# EAGLE schematic ig-normal2ver3 (EAGLE 9.6.2)
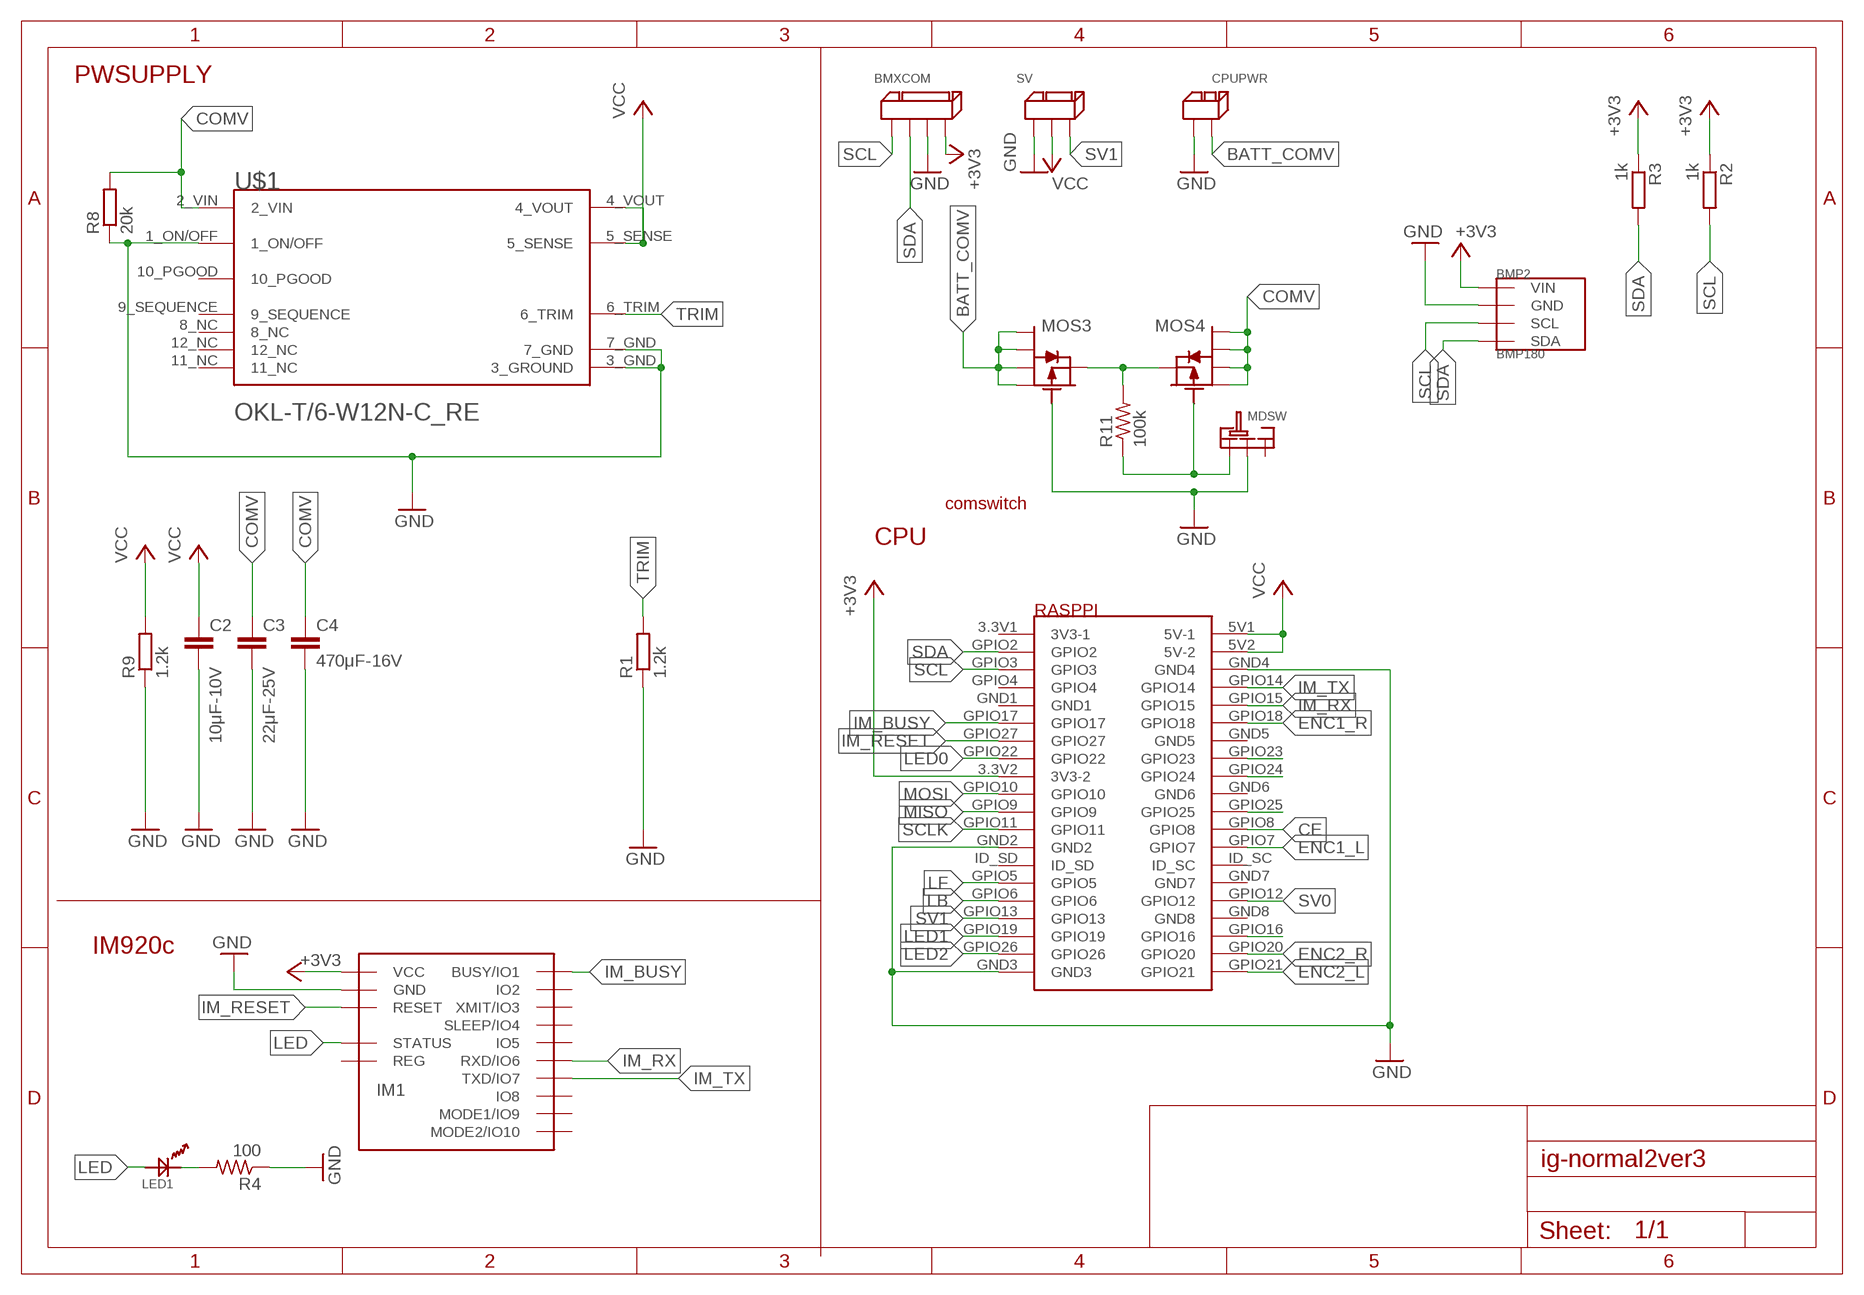
[diagram p0: schematic, sheet 1]

## Parts
BMP2  BMP180  [GY-68]
BMXCOM  4PIN  [4PIN]
C2  10μF-10V  C-EUC0603  [C0603]
C3  22μF-25V  C-EUC0603  [C0603]
C4  470μF-16V  C-EUC0603  [C0603]
CPUPWR  2PIN  [2PIN]
IM1  IM920_IM920C  [IM920_IM920C]
LED1  OSXX1608C1A  [OSXX1608C1A]
MDSW  SRIDE_SWITCH  [SRIDE_SWITCH]
MOS3  PCH_SSM6J808R  [SSM6J808R]
MOS4  PCH_SSM6J808R  [SSM6J808R]
R1  1.2k  R-EU_R0805  [R0805]
R2  1k  R-EU_R0603  [R0603]
R3  1k  R-EU_R0603  [R0603]
R4  100  R-US_R0603  [R0603]
R8  20k  R-EU_R0603  [R0603]
R9  1.2k  R-EU_R0805  [R0805]
R11  100k  R-US_R0603  [R0603]
RASPPI  RASPBERYPIZEROW  [RASPBERYPIZEROW]
SV  3PIN  [3PIN]
U$1  OKL-T/6-W12N-C_RE  [MURATA_IKL-T-6-W12N-C_0_RECOMENDED]

## Nets
+3V3: BMP2.P1(VIN) BMXCOM.P$4 IM1.$P17(VCC) R2.1 R3.1 RASPPI.3.3V2(3V3-2)
BATT_COMV: CPUPWR.P$2 MOS3.1 MOS3.2 MOS3.5 MOS3.6
CE: RASPPI.GPIO8
COMV: C3.1 C4.1 MOS4.1 MOS4.2 MOS4.5 MOS4.6 R8.2 U$1.2_VIN
ENC1_L: RASPPI.GPIO7
ENC1_R: RASPPI.GPIO18
ENC2_L: RASPPI.GPIO21
ENC2_R: RASPPI.GPIO20
GND: BMP2.P2(GND) BMXCOM.P$3 C2.2 C3.2 C4.2 CPUPWR.P$1 IM1.$P18(GND) MDSW.LR MOS3.3 R1.1 R4.1 R8.1 R9.1 RASPPI.GND2 RASPPI.GND3 RASPPI.GND4 SV.P$1 U$1.1_ON/OFF U$1.3_GND(3_GROUND) U$1.7_GND
IM_BUSY: IM1.$P1(BUSY/IO1) RASPPI.GPIO17
IM_RESET: IM1.$P19(RESET) RASPPI.GPIO27
IM_RX: IM1.$P6(RXD/IO6) RASPPI.GPIO15
IM_TX: IM1.$P7(TXD/IO7) RASPPI.GPIO14
LB: RASPPI.GPIO6
LB1: RASPPI.GPIO16
LED: IM1.$P15(STATUS) LED1.AN
LED0: RASPPI.GPIO22
LED1: RASPPI.GPIO19
LED2: RASPPI.GPIO26
LF: RASPPI.GPIO5
LF1: RASPPI.GPIO25
MISO: RASPPI.GPIO9
MOSI: RASPPI.GPIO10
N$3: LED1.CT R4.2
N$9: MOS3.4 MOS4.4 R11.2
N$10: MDSW.L MOS4.3 R11.1
RB1: RASPPI.GPIO24
RF1: RASPPI.GPIO23
SCL: BMP2.P3(SCL) BMXCOM.P$1 R2.2 RASPPI.GPIO3
SCLK: RASPPI.GPIO11
SDA: BMP2.P4(SDA) BMXCOM.P$2 R3.2 RASPPI.GPIO2
SV0: RASPPI.GPIO12
SV1: RASPPI.GPIO13 SV.P$3
TRIM: R1.2 U$1.6_TRIM
VCC: C2.1 R9.2 RASPPI.5V1(5V-1) RASPPI.5V2(5V-2) SV.P$2 U$1.4_VOUT U$1.5_SENSE
Unconnected: IM1.$P2(IO2) IM1.$P3(XMIT/IO3) IM1.$P4(SLEEP/IO4) IM1.$P5(IO5) IM1.$P8(IO8) IM1.$P9(MODE1/IO9) IM1.$P10(MODE2/IO10) IM1.$P16(REG) MDSW.R RASPPI.3.3V1(3V3-1) RASPPI.GND1 RASPPI.GND5 RASPPI.GND6 RASPPI.GND7 RASPPI.GND8 RASPPI.GPIO4 RASPPI.ID_SC RASPPI.ID_SD U$1.8_NC U$1.9_SEQUENCE U$1.10_PGOOD U$1.11_NC U$1.12_NC

## Notes on the sheet
- PWSUPPLY
- comswitch
- CPU
- IM920c

## Library data of the parts
BMP2 = BMP180:BMP180
BMXCOM = XR Connector:4PIN
C2-C4 = rcl:C-EU: CAPACITOR, European symbol; SPICEPREFIX: C
CPUPWR = XR Connector:2PIN
IM1 = CANSAT12th:IM920_IM920C
LED1 = Chip LED:OSXX1608C1A
MDSW = Sride Switch:SRIDE_SWITCH
MOS3 MOS4 = Chip MOSFET:PCH_SSM6J808R
R1-R3 R8 R9 = rcl:R-EU_: RESISTOR, European symbol; SPICEPREFIX: R
R4 R11 = rcl:R-US_: RESISTOR, American symbol; SPICEPREFIX: R
RASPPI = RaspberyPiZeroW:RASPBERYPIZEROW
SV = XR Connector:3PIN
U$1 = OKL-T_6-W12N-C:OKL-T/6-W12N-C_RE